# EAGLE design ITF_switching (EAGLE 8.2.2)

## Sheet 1 of 2
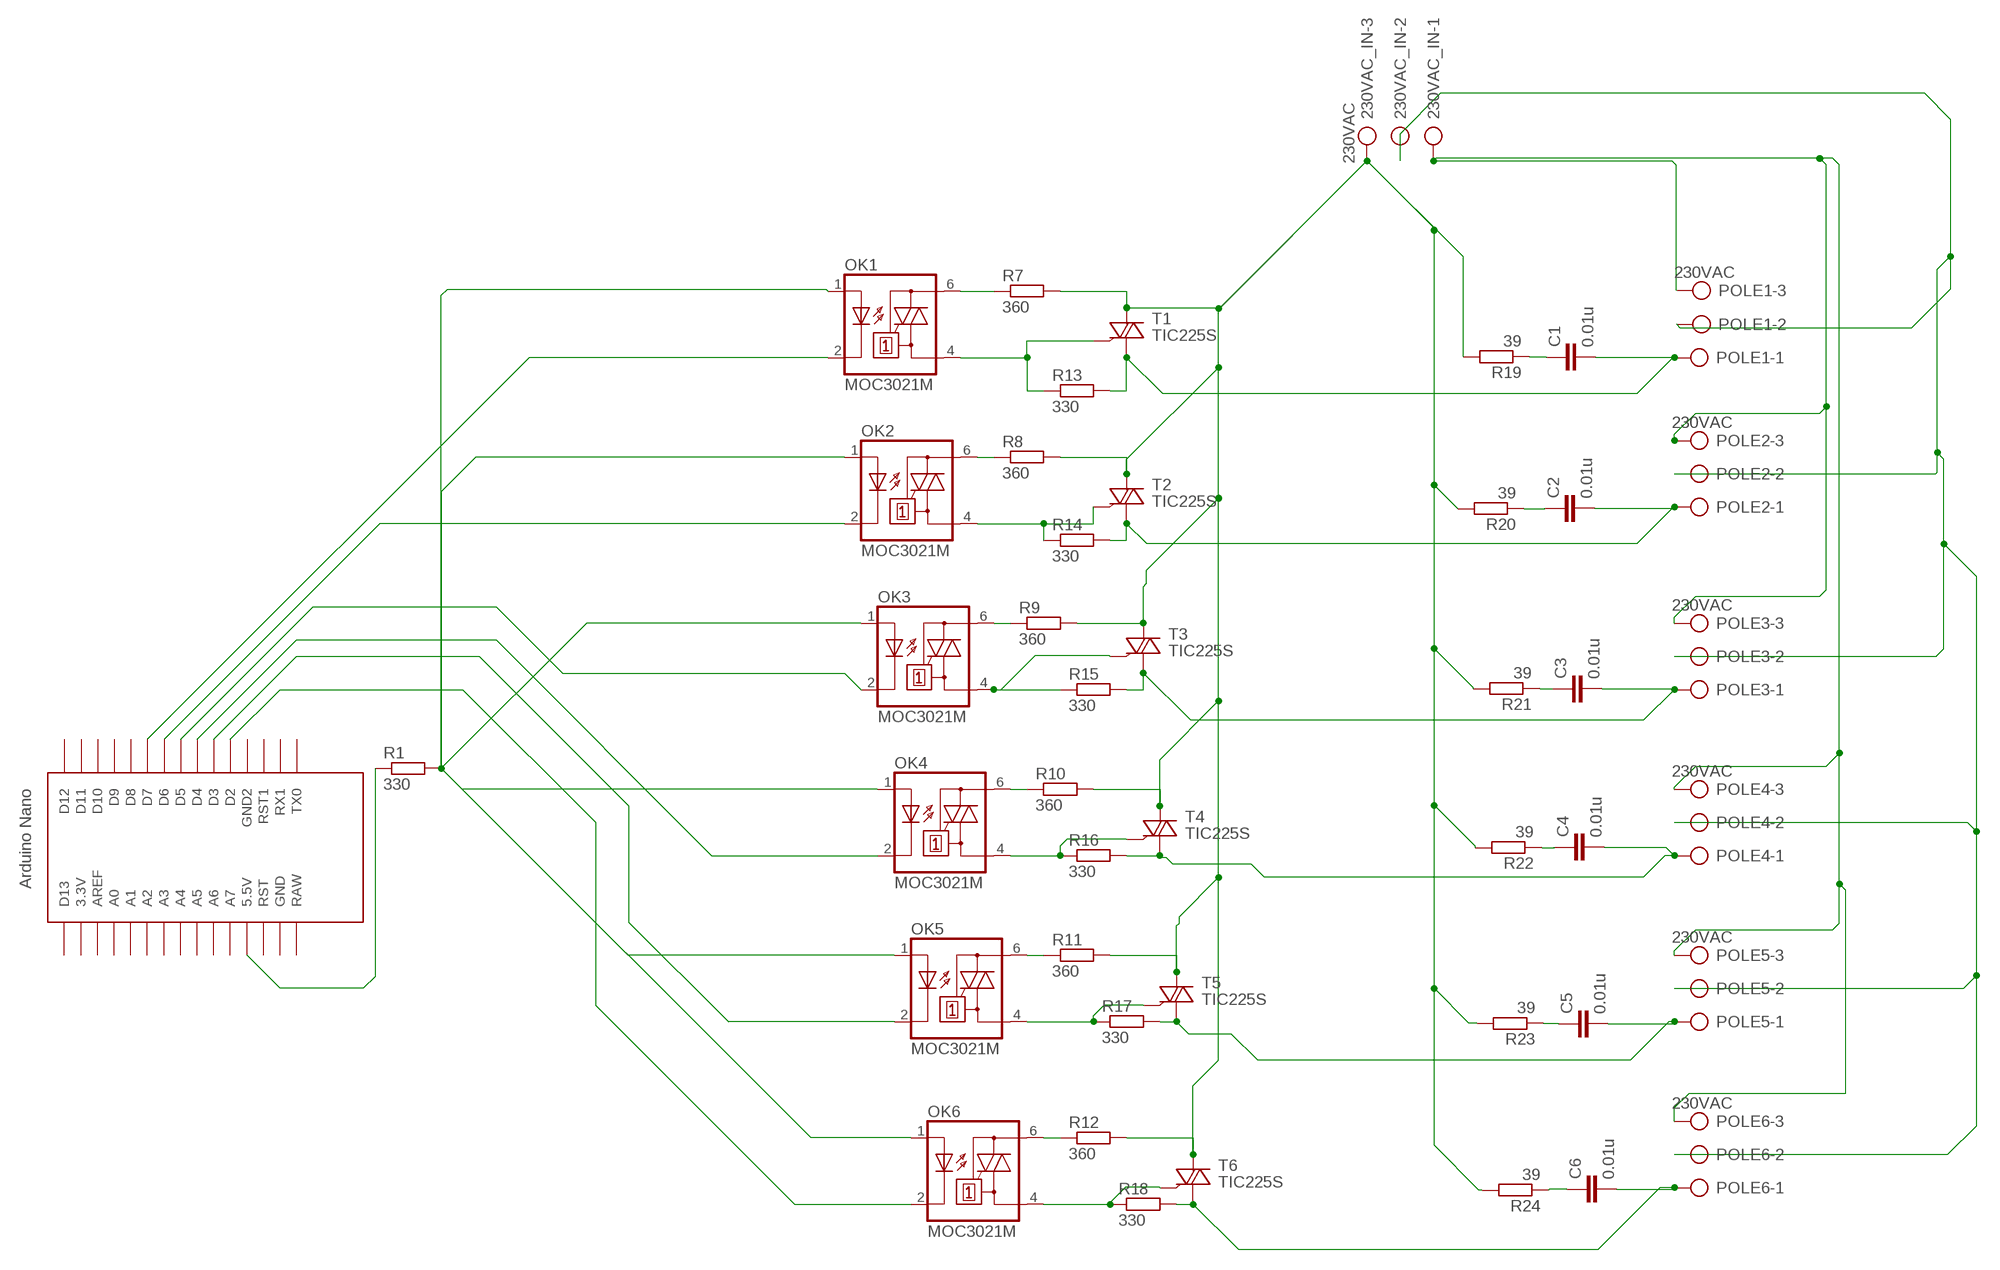
[diagram p0: schematic, sheet 1]

### Parts
230VAC_IN  230VAC  AK300/3  [AK300/3]
C1  0.01u  C2.5/6  [C2.5-6]
C2  0.01u  C2.5/6  [C2.5-6]
C3  0.01u  C2.5/6  [C2.5-6]
C4  0.01u  C2.5/6  [C2.5-6]
C5  0.01u  C2.5/6  [C2.5-6]
C6  0.01u  C2.5/6  [C2.5-6]
OK1  MOC3021M  [DIL06]
OK2  MOC3021M  [DIL06]
OK3  MOC3021M  [DIL06]
OK4  MOC3021M  [DIL06]
OK5  MOC3021M  [DIL06]
OK6  MOC3021M  [DIL06]
POLE1  230VAC  AK300/3  [AK300/3]
POLE2  230VAC  AK300/3  [AK300/3]
POLE3  230VAC  AK300/3  [AK300/3]
POLE4  230VAC  AK300/3  [AK300/3]
POLE5  230VAC  AK300/3  [AK300/3]
POLE6  230VAC  AK300/3  [AK300/3]
R1  330  R-EU_0207/10  [0207/10]
R7  360  R-EU_0207/10  [0207/10]
R8  360  R-EU_0207/10  [0207/10]
R9  360  R-EU_0207/10  [0207/10]
R10  360  R-EU_0207/10  [0207/10]
R11  360  R-EU_0207/10  [0207/10]
R12  360  R-EU_0207/10  [0207/10]
R13  330  R-EU_0207/10  [0207/10]
R14  330  R-EU_0207/10  [0207/10]
R15  330  R-EU_0207/10  [0207/10]
R16  330  R-EU_0207/10  [0207/10]
R17  330  R-EU_0207/10  [0207/10]
R18  330  R-EU_0207/10  [0207/10]
R19  39  R-EU_0207/10  [0207/10]
R20  39  R-EU_0207/10  [0207/10]
R21  39  R-EU_0207/10  [0207/10]
R22  39  R-EU_0207/10  [0207/10]
R23  39  R-EU_0207/10  [0207/10]
R24  39  R-EU_0207/10  [0207/10]
T1  TIC225S  [TO220DS]
T2  TIC225S  [TO220DS]
T3  TIC225S  [TO220DS]
T4  TIC225S  [TO220DS]
T5  TIC225S  [TO220DS]
T6  TIC225S  [TO220DS]
U$1  NANO  [NANO]

### Nets
N$1: R1.1 U$1.5V(5.5V)
N$2 [POWER]: OK1.1(A) OK2.1(A) OK3.1(A) OK4.1(A) OK5.1(A) OK6.1(A) R1.2
N$3: OK6.2(C) U$1.D2
N$4: OK5.2(C) U$1.D3
N$5: OK4.2(C) U$1.D4
N$6: OK3.2(C) U$1.D5
N$7: OK2.2(C) U$1.D6
N$8: OK1.2(C) U$1.D7
N$14: OK1.6(A2) R7.1
N$15 [POWER]: 230VAC_IN.1 POLE1.3 POLE2.3 POLE3.3 POLE4.3 POLE5.3 POLE6.3
N$16: OK2.6(A2) R8.1
N$17 [POWER]: C3.1 R21.1
N$18: OK3.6(A2) R9.1
N$19 [POWER]: OK3.4(A1) R15.1 T3.G
N$20: OK4.6(A2) R10.1
N$21 [POWER]: C1.2 POLE1.1 R13.2 T1.A1
N$22: OK5.6(A2) R11.1
N$23 [POWER]: C2.2 POLE2.1 R14.2 T2.A1
N$24: OK6.6(A2) R12.1
N$25 [POWER]: C3.2 POLE3.1 R15.2 T3.A1
N$26: OK2.4(A1) R14.1 T2.G
N$27: OK1.4(A1) R13.1 T1.G
N$28: OK4.4(A1) R16.1 T4.G
N$29: OK5.4(A1) R17.1 T5.G
N$30: OK6.4(A1) R18.1 T6.G
N$34 [POWER]: C4.2 POLE4.1 R16.2 T4.A1
N$35 [POWER]: C6.1 R24.1
N$36 [POWER]: C5.1 R23.1
N$37 [POWER]: C4.1 R22.1
N$38 [POWER]: C2.1 R20.1
N$39 [POWER]: 230VAC_IN.3 R7.2 R8.2 R9.2 R10.2 R11.2 R12.2 R19.2 R20.2 R21.2 R22.2 R23.2 R24.2 T1.A2 T2.A2 T3.A2 T4.A2 T5.A2 T6.A2
N$41: C1.1 R19.1
N$48 [POWER]: C5.2 POLE5.1 R17.2 T5.A1
N$50 [POWER]: 230VAC_IN.2 POLE1.2 POLE2.2 POLE3.2 POLE4.2 POLE5.2 POLE6.2
N$51 [POWER]: C6.2 POLE6.1 R18.2 T6.A1
Unconnected: U$1.3.3V U$1.A0 U$1.A1 U$1.A2 U$1.A3 U$1.A4 U$1.A5 U$1.A6 U$1.A7 U$1.AREF U$1.D8 U$1.D9 U$1.D10 U$1.D11 U$1.D12 U$1.D13 U$1.GND U$1.GND1(GND2) U$1.ICSP1 U$1.ICSP2 U$1.ICSP3 U$1.ICSP4 U$1.ICSP5 U$1.ICSP6 U$1.RAW U$1.RST U$1.RST1 U$1.RX1 U$1.TX0

## Sheet 2 of 2

## Library data of the parts
230VAC_IN POLE1-POLE6 = con-ptr500:AK300/3: CONNECTOR; OC_FARNELL: unknown; OC_NEWARK: unknown
C1-C6 = capacitor-wima:C: CAPACITOR naming: grid - package width
OK1-OK6 = optocoupler:MOC30*M: RANDOM-PHASE OPTOISOLATORS TRIAC DRIVER OUTPUT Source: http://www.fairchildsemi.com MOC3020-M.pdf; MF: FAIRCHILD SEMICONDUCTOR; MPN: MOC3021-M; OC_FARNELL: 1021365; OC_NEWARK: 95B7895
R1 R7-R24 = resistor:R-EU_: RESISTOR, European symbol
T1-T6 = triggered_devices:TIC225S: TRIAC
U$1 = Arduino-clone:NANO: Arduino Nano

## Net classes
0 default: clearance 0.205 mm
1 POWER: width 1.143 mm, clearance 0.205 mm to class 0, clearance 0.205 mm

## Board
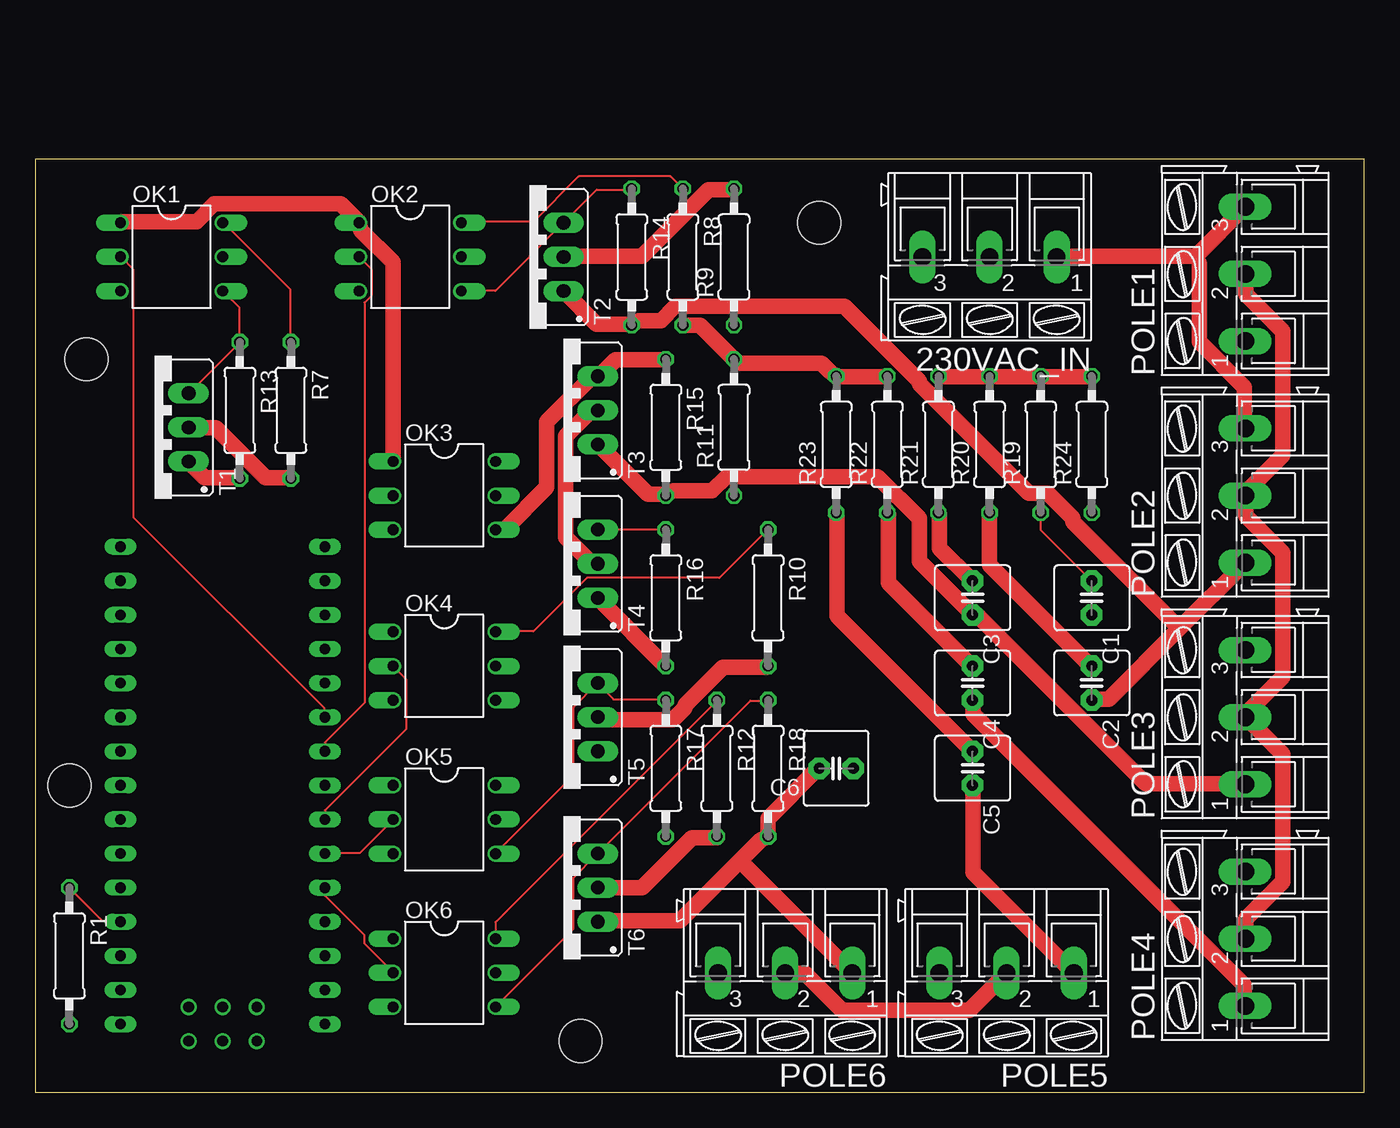
[diagram p1: board, top side]
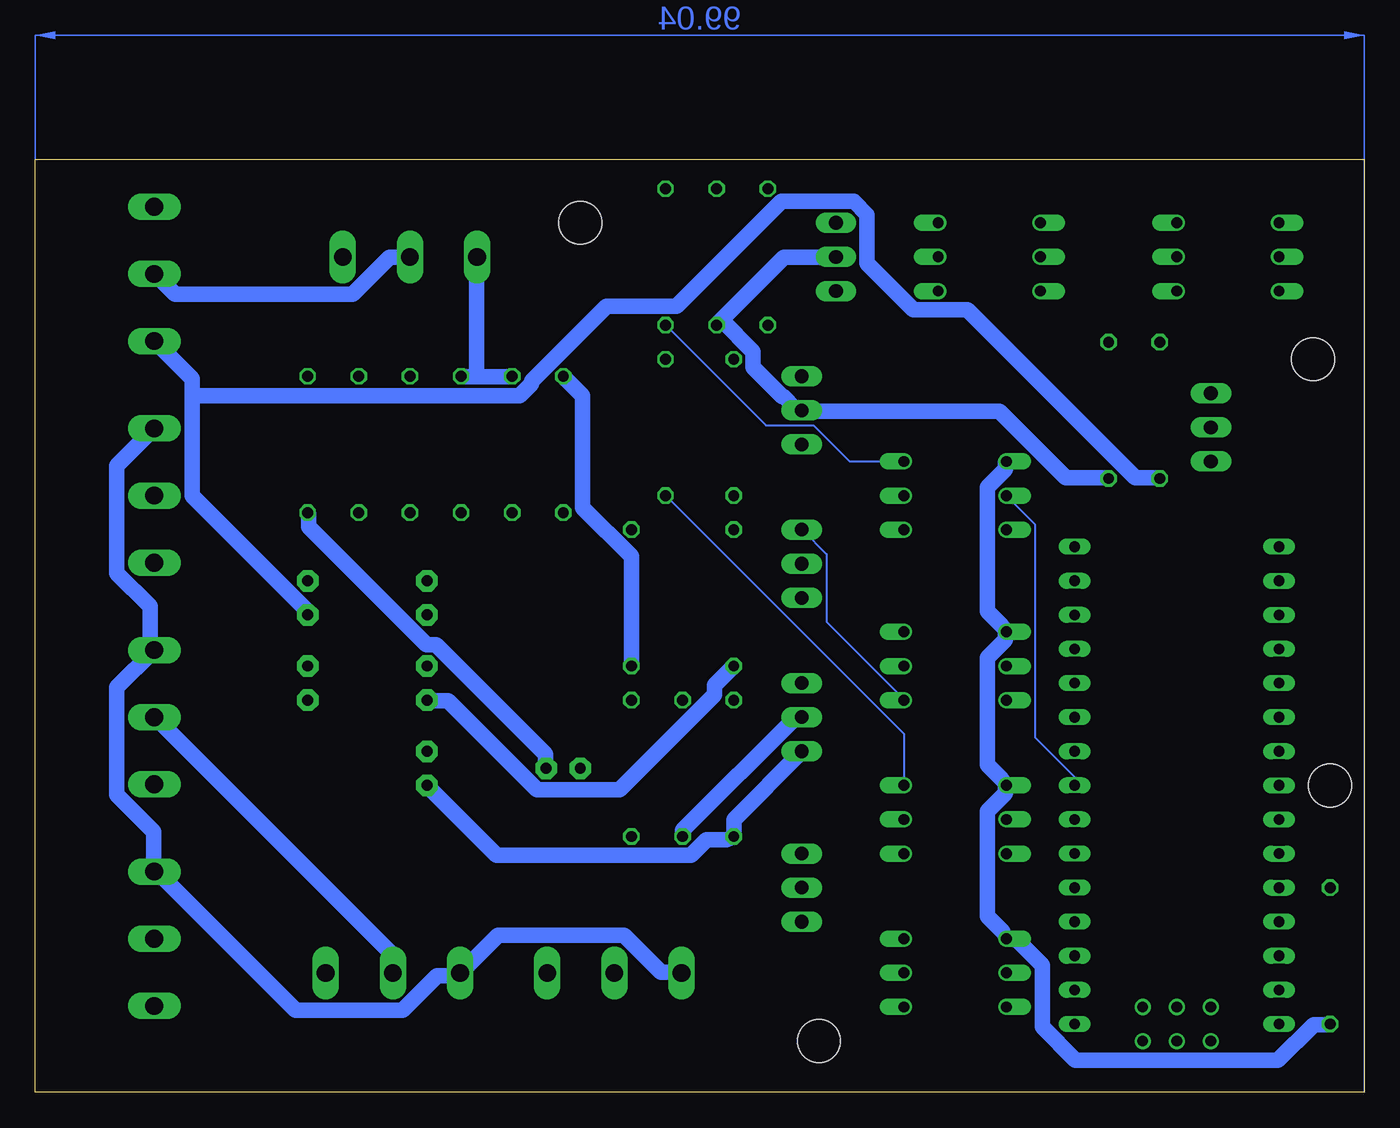
[diagram p2: board, bottom side, seen from below]

Size 99.04 x 69.52 mm. Coordinates in mm from the lower left corner, seen from the top.
Outline: 0,0 99.04,0 99.04,69.52 0,69.52 0,0
Copper layers (1*16): Top 0.018mm / dielectric 1.55mm / Bottom 0.018mm
Design rules "eC_2Layer_PClass6_BaseCopperO18_eCDefault": minimum track width 0.15mm, minimum drill 0.35mm, track to track 0.15mm, track to pad 0.15mm, pad to pad 0.15mm, via to via 0.15mm, smd to smd 0mil, copper to edge 0.25mm, drill to drill 0.35mm, minimum pad ring 0.175mm, minimum via ring 0.125mm, stop-mask expansion 0mil, vias tented up to drill 0.45mm, thermal gap 0.2mm
Holes 3.2 mm at 3.81,54.61 2.54,22.86 40.64,3.81 58.42,64.77

### Footprints (pad centres in the part's own frame; a part is rotated, then mirrored left to right if it is on the bottom)
AK300/3 = drill 1.321 long: 1 -5.004,0; 2 0,0; 3 5.004,0
C2.5-6 = drill 0.813 pad 1.6 octagon: 1 -1.27,0; 2 1.27,0
DIL06 = drill 0.813 offset: 1 -2.54,-3.81; 2 0,-3.81; 3 2.54,-3.81; 4 2.54,3.81; 5 0,3.81; 6 -2.54,3.81
0207/10 = drill 0.813 octagon: 1 -5.08,0; 2 5.08,0
TO220DS = drill 1.016 long: A1 -2.54,-2.54; A2 0,-2.54; G 2.54,-2.54
NANO = drill 0.8 long: 3.3V -10.16,24.13; 5V -10.16,-1.27; A0 -10.16,19.05; A1 -10.16,16.51; A2 -10.16,13.97; A3 -10.16,11.43; A4 -10.16,8.89; A5 -10.16,6.35; A6 -10.16,3.81; A7 -10.16,1.27; AREF -10.16,21.59; D2 5.08,1.27; D3 5.08,3.81; D4 5.08,6.35; D5 5.08,8.89; D6 5.08,11.43; D7 5.08,13.97; D8 5.08,16.51; D9 5.08,19.05; D10 5.08,21.59; D11 5.08,24.13; D12 5.08,26.67; D13 -10.16,26.67; GND -10.16,-6.35; GND1 5.08,-1.27; RAW -10.16,-8.89; RST -10.16,-3.81; RST1 5.08,-3.81; RX1 5.08,-6.35; TX0 5.08,-8.89 | drill 0.8: ICSP1 -5.08,-10.16; ICSP2 -5.08,-7.62; ICSP3 -2.54,-10.16; ICSP4 -2.54,-7.62; ICSP5 0,-10.16; ICSP6 0,-7.62

### Placement (x,y rotation side)
230VAC_IN  71.12,62.23 180 top
C1  78.74,36.83 270 top
C2  78.74,30.48 270 top
C3  69.85,36.83 270 top
C4  69.85,30.48 270 top
C5  69.85,24.13 270 top
C6  59.69,24.13 180 top
OK1  10.16,62.23 270 top
OK2  27.94,62.23 270 top
OK3  30.48,44.45 270 top
OK4  30.48,31.75 270 top
OK5  30.48,20.32 270 top
OK6  30.48,8.89 270 top
POLE1  90.17,60.96 90 top
POLE2  90.17,44.45 90 top
POLE3  90.17,27.94 90 top
POLE4  90.17,11.43 90 top
POLE5  72.39,8.89 180 top
POLE6  55.88,8.89 180 top
R1  2.54,10.16 270 top
R7  19.05,50.8 270 top
R8  48.26,62.23 270 top
R9  52.07,62.23 90 top
R10  54.61,36.83 270 top
R11  52.07,49.53 90 top
R12  50.8,24.13 270 top
R13  15.24,50.8 270 top
R14  44.45,62.23 270 top
R15  46.99,49.53 270 top
R16  46.99,36.83 270 top
R17  46.99,24.13 270 top
R18  54.61,24.13 270 top
R19  74.93,48.26 90 top
R20  71.12,48.26 90 top
R21  67.31,48.26 90 top
R22  63.5,48.26 90 top
R23  59.69,48.26 90 top
R24  78.74,48.26 90 top
T1  8.89,49.53 90 top
T2  36.83,62.23 90 top
T3  39.37,50.8 90 top
T4  39.37,39.37 90 top
T5  39.37,27.94 90 top
T6  39.37,15.24 90 top
U$1  16.51,13.97 0 top

### Tracks (layer width: path | path; a pad name or v marks a point on that pad's centre or on a via)
N$1
  Top 0.15: U$1.5V 6.33,12.76 5,12.76 2.61,15.15 R1.1
N$2
  Top 1.143: OK1.1 6.42,64.86 12.02,64.86 13.35,66.19 22.75,66.19 24.09,64.86 OK2.1 24.26,64.23 26.66,61.84 26.66,47.02 OK3.1
  Bottom 1.143: R1.2 2.61,5.04 3.76,5.04 6.42,2.38 21.51,2.38 24,4.86 24,9.47 25.95,11.43 OK6.1 26.93,11.96 28.08,13.11 28.08,20.92 26.75,22.26 26.75,22.79 OK5.1 27.01,23.32 28.08,24.38 28.08,32.37 26.75,33.7 26.75,34.24 OK4.1 27.01,34.77 28.08,35.83 28.08,45.06 26.75,46.4 26.75,46.93 OK3.1
N$3
  Top 0.15: U$1.D2 21.6,15.15 21.6,14.62 24.53,11.69 24.53,11.07 26.66,8.94 OK6.2
N$4
  Top 0.15: U$1.D3 21.6,17.82 24.17,17.82 26.66,20.3 OK5.2
N$5
  Top 0.15: U$1.D4 21.6,20.39 21.6,21.01 27.64,27.05 27.64,30.77 26.75,31.66 OK4.2
N$6
  Bottom 0.15: U$1.D5 21.6,22.88 21.6,23.5 24.53,26.43 24.53,42.31 OK3.2
N$7
  Top 0.15: U$1.D6 21.6,25.45 21.6,26.07 24.53,29 24.53,58.82 25.06,59.35 25.06,61.31 24.17,62.19 OK2.2
N$8
  Top 0.15: U$1.D7 21.51,28.02 21.51,28.65 7.31,42.84 7.31,61.31 6.42,62.19 OK1.2
N$14
  Top 0.15: OK1.6 14.06,64.77 19.03,59.8 19.03,55.89 R7.1
N$15
  Top 1.143: 86.48,62.28 76.18,62.28 230VAC_IN.1 | 86.48,62.28 90.11,65.92 POLE1.3 | POLE2.3 90.11,49.5 90.11,52.52 86.74,55.89 86.74,61.75 86.48,62.28
  Bottom 1.143: POLE6.3 50.89,8.94 52.4,8.94 55.15,11.69 64.55,11.69 67.31,8.94 POLE5.3 67.93,8.68 69.08,8.68 71.65,6.1 79.64,6.1 89.67,16.13 POLE4.3 90.2,16.49 90.2,19.41 92.95,22.17 92.95,30.15 90.2,32.91 POLE3.3 90.47,33.44 90.47,36.19 92.95,38.67 92.95,46.66 90.2,49.41 POLE2.3
N$16
  Top 0.15: OK2.6 31.81,64.86 37.13,64.86 40.5,68.23 47.34,68.23 48.23,67.34 R8.1
N$17
  Top 1.143: R21.1 67.39,43.11 67.39,40.54 69.79,38.14 C3.1
N$18
  Bottom 0.15: OK3.6 34.29,47.02 38.37,47.02 41.04,49.68 44.59,49.68 52.04,57.13 R9.1
N$19
  Top 1.143: OK3.4 34.29,41.96 35,41.96 38.11,45.06 38.11,49.95 41.48,53.32 41.84,53.32 T3.G 42.37,53.67 43.26,54.56 46.98,54.56 R15.1
N$20
  Top 0.15: OK4.6 34.29,34.33 37.13,34.33 41.12,38.32 50.98,38.32 54.53,41.87 R10.1
N$21
  Top 1.143: R13.2 15.21,45.77 12.64,45.77 11.48,46.93 T1.A1
  Bottom 1.143: 87.36,51.9 87.36,53.14 90.11,55.89 POLE1.1 | 87.36,51.9 87.36,44.44 78.75,35.83 78.75,35.57 C1.2 | 87.36,51.9 62.96,51.9 62.07,52.79 62.07,52.96 56.48,58.55 51.24,58.55 43.43,66.36 38.02,66.36 37.04,65.39 37.04,61.75 33.58,58.29 29.59,58.29 17.07,45.77 15.3,45.77 R13.2
N$22
  Bottom 0.15: OK5.6 34.29,22.88 34.29,26.69 52.04,44.44 R11.1
N$23
  Top 1.143: T2.A1 39.44,59.62 41.84,57.22 44.41,57.22 R14.2 44.94,57.49 46.63,57.49 47.69,58.55 60.3,58.55 65.89,52.96 65.89,52.79 74.05,44.62 75.47,44.62 77.33,42.76 77.33,42.49 85.28,34.55 | 85.28,34.55 90.11,39.38 POLE2.1 | 85.28,34.55 80,29.27 78.75,29.27 C2.2
N$24
  Top 0.15: OK6.6 34.29,11.52 34.29,12.67 50.8,29.18 R12.1
N$25
  Top 1.143: 46.98,44.53 45.65,44.53 41.92,48.26 T3.A1 | 46.98,44.53 R15.2 | POLE3.1 90.11,22.97 82.75,22.97 70.23,35.48 69.88,35.48 C3.2 69.44,36.01 65.89,39.56 65.89,42.76 62.78,45.86 51.51,45.86 50.44,44.8 47.52,44.8 46.98,44.53
N$26
  Top 0.15: OK2.4 31.81,59.71 34.29,59.71 39.35,64.77 T2.G 39.44,64.86 41.84,67.25 44.41,67.25 R14.1
N$27
  Top 0.15: OK1.4 14.06,59.62 15.21,58.47 15.21,55.89 R13.1 15.21,55.8 11.48,52.08 T1.G
N$28
  Top 0.15: R16.1 46.98,41.96 41.92,41.96 T4.G
  Bottom 0.15: OK4.4 34.29,29.27 40.06,35.04 40.06,40.09 41.84,41.87 T4.G
N$29
  Top 0.15: OK5.4 34.29,17.82 40.06,23.59 40.06,28.65 41.84,30.42 T5.G 41.92,30.42 43.08,29.27 46.98,29.27 R17.1
N$30
  Top 0.15: OK6.4 34.29,6.37 40.06,12.14 40.06,15.95 41.84,17.73 T6.G 41.92,17.82 53.28,29.18 54.53,29.18 R18.1
N$34
  Top 1.143: R16.2 41.92,36.81 T4.A1 | POLE4.1 90.11,6.46 90.11,7.97 69.88,28.2 69.88,29.18 C4.2
  Bottom 1.143: C4.2 69.79,29.18 68.28,29.18 61.63,22.52 55.5,22.52 48.4,29.62 48.4,30.33 47.07,31.66 R16.2
N$35
  Bottom 1.143: R24.1 78.67,43.11 78.67,42.14 69.88,33.35 69.17,33.35 61.01,25.18 61.01,24.21 C6.1
N$36
  Top 1.143: R23.1 59.76,43.11 59.76,35.48 69.79,25.45 C5.1
N$37
  Top 1.143: R22.1 63.58,43.11 63.58,37.96 69.79,31.75 C4.1
N$38
  Top 1.143: R20.1 71.12,43.11 71.12,39.3 78.67,31.75 C2.1
N$39
  Top 1.143: R7.2 19.03,45.77 17.16,45.77 13.43,49.5 11.48,49.5 T1.A2 | T4.A2 41.84,39.38 41.48,39.38 39.53,41.34 39.53,48.88 41.39,50.74 41.84,50.74 T3.A2 | R12.2 50.8,18.97 48.94,18.97 45.21,15.24 41.92,15.24 T6.A2 | R10.2 54.53,31.66 51.24,31.66 48.4,28.82 48.4,28.65 47.52,27.76 42.1,27.76 41.92,27.94 T5.A2 | R9.2 52.04,67.25 50.18,67.25 45.21,62.28 39.44,62.28 T2.A2 | R8.2 48.31,57.13 49.56,57.13 52.04,54.65 R11.2 52.57,54.29 58.61,54.29 59.23,53.67 R23.2 59.76,53.32 63.49,53.32 R22.2 | R21.2 67.39,53.32 71.03,53.32 R20.2 71.65,53.32 74.85,53.32 R19.2 75.47,53.32 78.67,53.32 R24.2
  Bottom 1.143: R7.2 19.12,45.77 22.22,45.77 27.19,50.74 41.84,50.74 T3.A2 42.46,51.01 43.26,51.81 43.34,51.81 45.56,54.03 45.56,55.18 47.91,57.53 | R12.2 50.8,19.5 42.37,27.94 41.92,27.94 T5.A2 | 66.15,53.32 67.31,53.32 R21.2 | 66.15,53.32 63.58,53.32 R22.2 | 66.15,53.32 66.15,62.19 230VAC_IN.3 | 47.91,57.53 48.23,57.22 R8.2 | 47.91,57.53 43.26,62.19 39.44,62.19 T2.A2 | R10.2 54.62,39.92 58.25,43.55 58.25,51.9 59.67,53.32 R23.2
N$41
  Top 0.15: R19.1 74.94,43.11 74.94,41.87 78.67,38.14 C1.1
N$48
  Top 1.143: C5.2 69.88,22.79 69.88,16.4 77.33,8.94 POLE5.1
  Bottom 1.143: T5.A1 41.92,25.36 46.98,20.3 R17.2 47.52,18.79 49.02,18.79 50.18,17.64 64.64,17.64 69.79,22.79 C5.2
N$50
  Top 1.143: POLE6.2 55.95,8.85 57.37,8.85 60.12,6.1 69.61,6.1 72.36,8.85 POLE5.2 | POLE4.2 90.2,11.52 90.2,12.94 92.95,15.69 92.95,25.18 90.2,27.94 POLE3.2 90.47,28.47 92.95,30.95 92.95,40.18 90.2,42.93 90.2,44.44 POLE2.2 90.47,44.98 92.95,47.46 92.95,56.69 90.2,59.44 90.2,60.95 POLE1.2
  Bottom 1.143: 230VAC_IN.2 71.12,62.19 72.63,62.19 75.38,59.44 88.61,59.44 90.11,60.95 POLE1.2 | POLE5.2 72.45,8.94 72.45,10.27 90.11,27.94 POLE3.2
N$51
  Top 1.143: C6.2 58.34,24.12 54.62,20.39 R18.2 54.08,18.79 52.53,17.24 | 52.53,17.24 48.05,12.76 41.92,12.76 T6.A1 | 52.53,17.24 60.83,8.94 POLE6.1
(copper drawn outside any net)
  shapes: Bottom area x2